# EasyEDA Pro project PD_Fan.eprj

# Schematic Schematic1
Create Date: 2024-09-08; Page Name: P1; Project Name: PD_Fan; Schematic Name: Schematic1; Update Date: 2024-09-22; Company: 嘉立创EDA; Page Size: A4; Version: V1.0
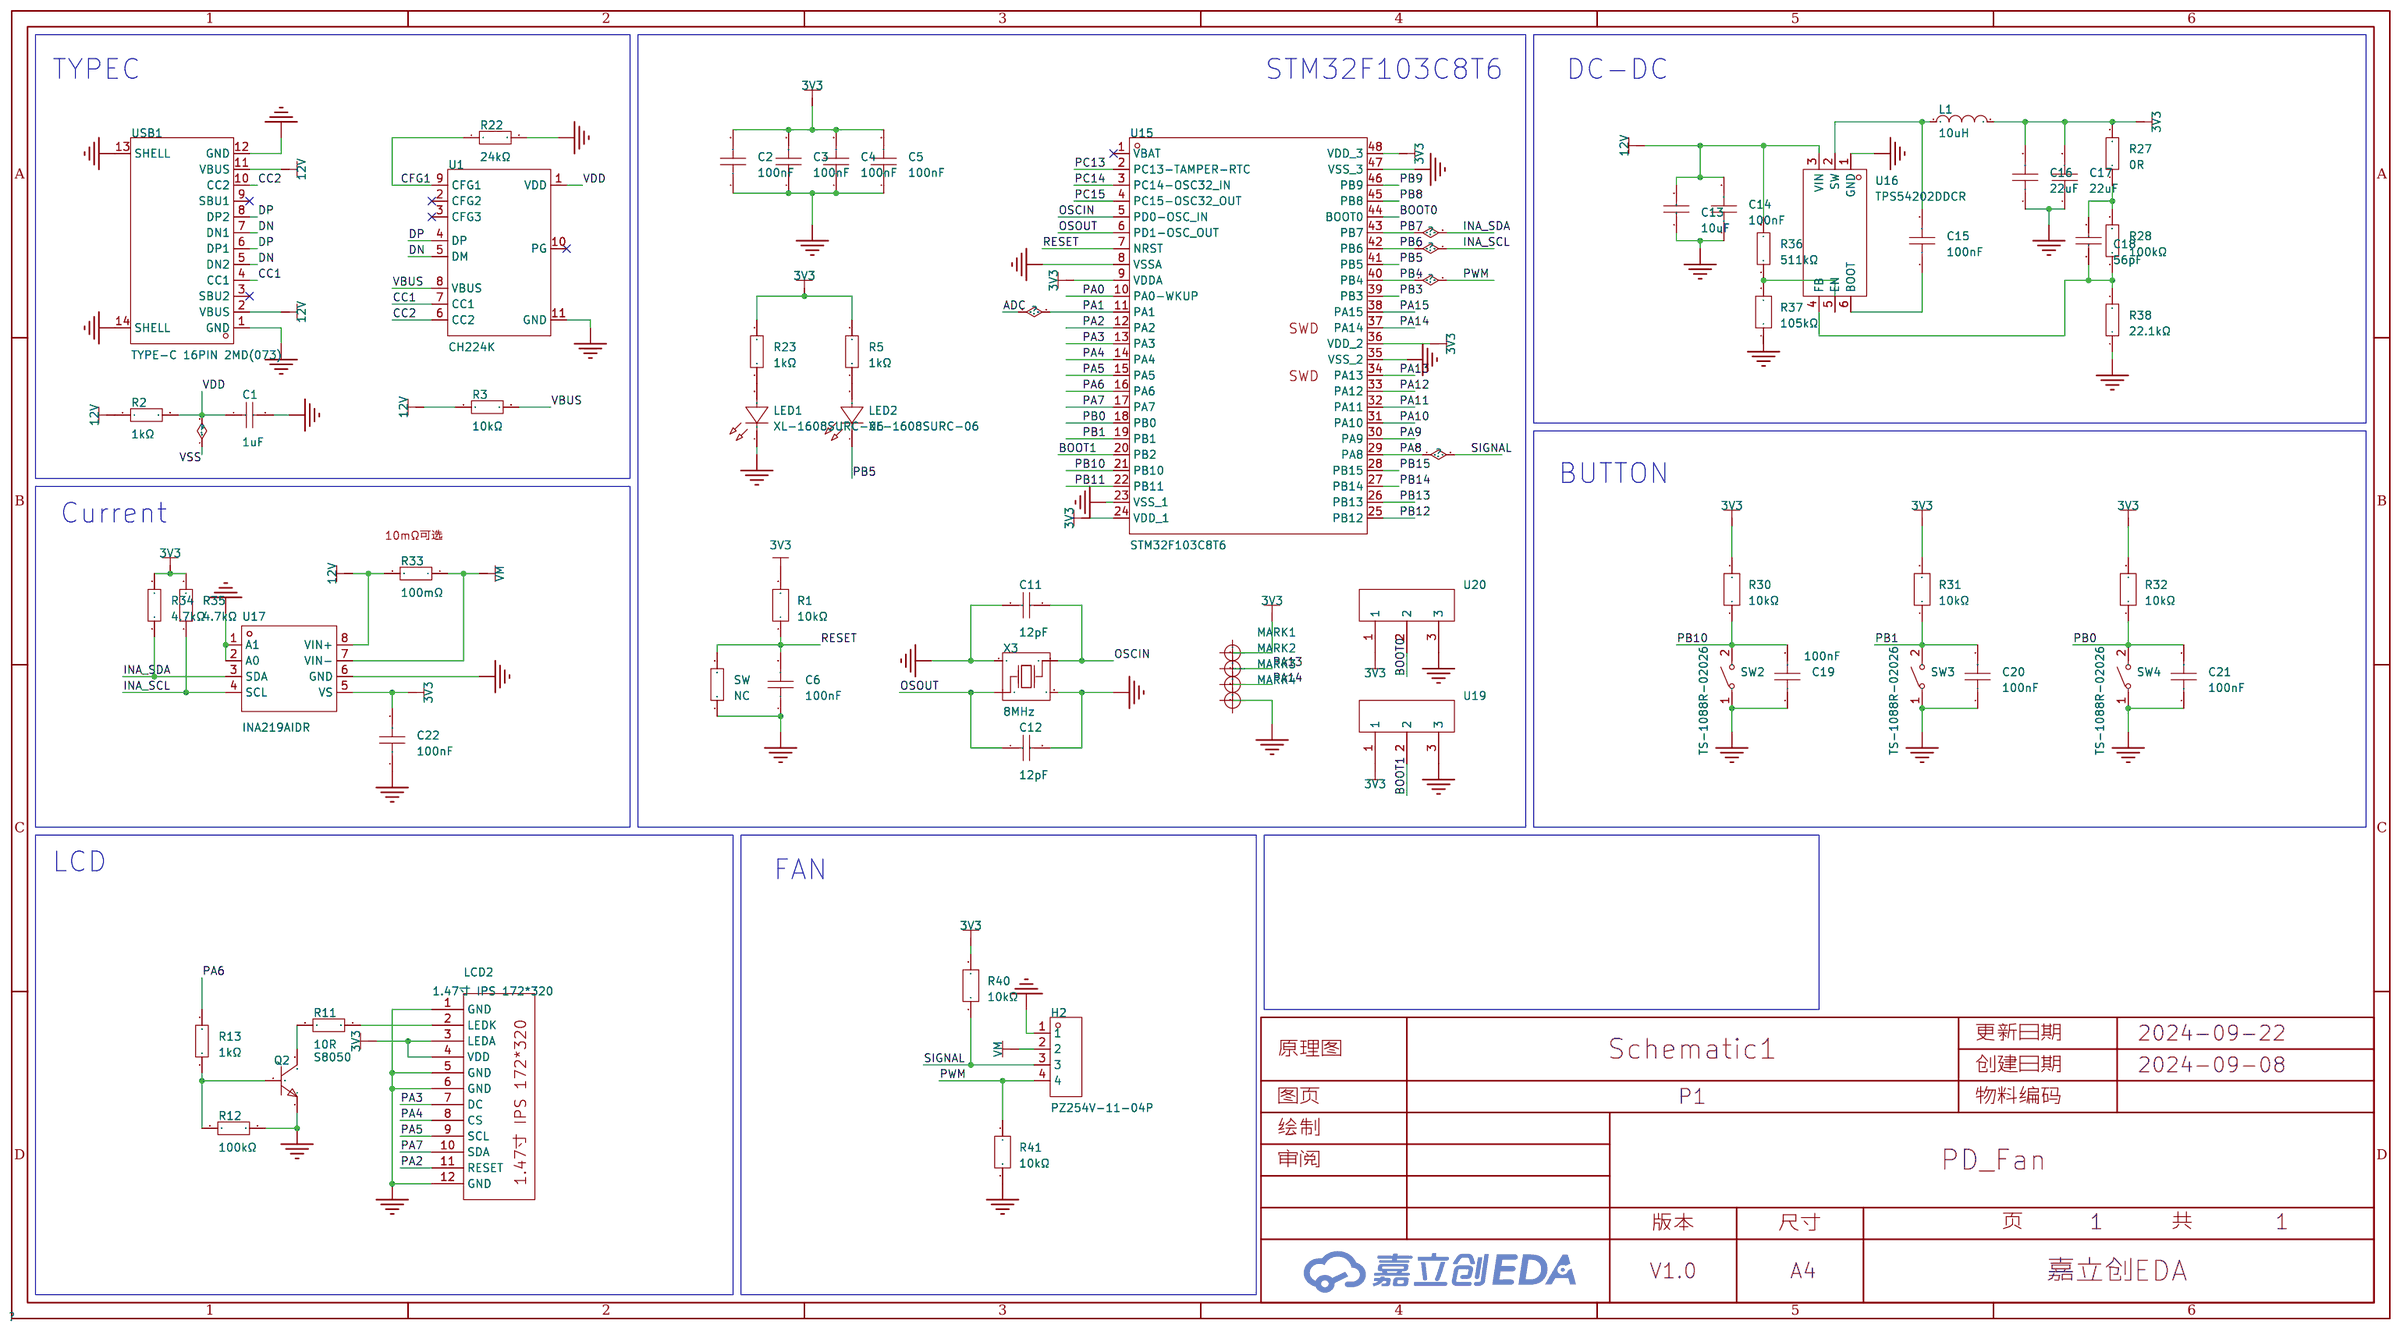
[diagram p0: schematic sheet]

## Parts
C1  1uF  [C0603]
C2  100nF  [C0603]
C3  100nF  [C0603]
C4  100nF  [C0603]
C5  100nF  [C0603]
C6  100nF  [C0603]
C11  12pF  [C0603]
C12  12pF  [C0603]
C13  10uF  [C0805]
C14  100nF  [C0603]
C15  100nF  [C0603]
C16  22uF  [C0805]
C17  22uF  [C0805]
C18  56pF  [C0603]
C19  100nF  [C0603]
C20  100nF  [C0603]
C21  100nF  [C0603]
C22  100nF  [C0603]
H2  PZ254V-11-04P  [HDR-TH_4P-P2.54-V-M]
L1  10uH  [IND-SMD_L2.5-W2.0]
LCD2  1.47寸 IPS 172*320  [1.47 ips lcd]
LED1  XL-1608SURC-06  [LED0603-RD_RED]
LED2  XL-1608SURC-06  [LED0603-RD_RED]
MARK1  -  [Mark-Point-1mm]  (no BOM)
MARK2  -  [Mark-Point-1mm]  (no BOM)
MARK3  -  [Mark-Point-1mm]  (no BOM)
MARK4  -  [Mark-Point-1mm]  (no BOM)
Q2  S8050  [SOT-23-3_L2.9-W1.3-P1.90-LS2.4-BR]
R1  10kΩ  [R0603]
R2  1kΩ  [R0603]
R3  10kΩ  [R0603]
R5  1kΩ  [R0603]
R11  10R  [R0603]
R12  100kΩ  [R0603]
R13  1kΩ  [R0603]
R22  24kΩ  [R0603]
R23  1kΩ  [R0603]
R27  0R  [R0603]
R28  100kΩ  [R0603]
R30  10kΩ  [R0603]
R31  10kΩ  [R0603]
R32  10kΩ  [R0603]
R33  100mΩ  [R1206]
R34  4.7kΩ  [R0603]
R35  4.7kΩ  [R0603]
R36  511kΩ  [R0603]
R37  105kΩ  [R0603]
R38  22.1kΩ  [R0603]
R40  10kΩ  [R0603]
R41  10kΩ  [R0603]
SW  10K  [R0603]
SW2  TS-1088R-02026  [SW-SMD_L3.9-W3.0-P4.45]
SW3  TS-1088R-02026  [SW-SMD_L3.9-W3.0-P4.45]
SW4  TS-1088R-02026  [SW-SMD_L3.9-W3.0-P4.45]
U1  CH224K  [ESSOP-10_L4.9-W3.9-P1.0-LS6.0-TL-EP]
U15  STM32F103C8T6  [LQFP-48_L7.0-W7.0-P0.50-LS9.0-BL]
U16  TPS54202DDCR  [SOT-23-6_L2.9-W1.6-P0.95-LS2.8-BL]
U17  INA219AIDR  [SOIC-8_L4.9-W3.9-P1.27-LS6.0-BL]
U19  -  [switch]
U20  -  [switch]
USB1  TYPE-C 16PIN 2MD(073)  [USB-C-SMD_TYPE-C-6PIN-2MD-073]
X3  8MHz  [OSC-SMD_4P-L3.2-W2.5-BL]

## Library data of the parts
C1 = CL10A105KB8NNNC: 容值:1uF;精度:±10%;额定电压:50V;材质(温度系数):X5R;; LCSC Part Name: 1uF ±10% 50V; Supplier Part: C15849; Manufacturer: SAMSUNG(三星); Supplier Footprint: 0603; JLCPCB Part Class: 基础库; Datasheet: https://atta.szlcsc.com/upload/public/pdf/source/20160218/1457707763339.pdf; Supplier: LCSC; Tolerance: ±10%; Voltage Rated: 50V; Temperature Coefficient: X5R
C2-C5 C14 C15 C19-C22 = CGA0603X7R104K500JT: 容值:100nF;精度:±10%;额定电压:50V;材质(温度系数):X7R;; LCSC Part Name: 100nF ±10% 50V; Supplier Part: C6119867; Manufacturer: HRE(芯声); Supplier Footprint: 0603; JLCPCB Part Class: Extended Part; Supplier: LCSC; Tolerance: ±10%; Voltage Rated: 50V; Temperature Coefficient: X7R
C6 = CC0603KRX7R9BB104: 容值:100nF;精度:±10%;额定电压:50V;材质(温度系数):X7R;; LCSC Part Name: 100nF ±10% 50V; Supplier Part: C14663; Manufacturer: YAGEO(国巨); Supplier Footprint: 0603; JLCPCB Part Class: Basic Part; Datasheet: https://atta.szlcsc.com/upload/public/pdf/source/20180910/C282072_33301C7F631E79921B82A8DAC6BCC5B3.pdf; Supplier: LCSC; Tolerance: ±10%; Voltage Rated: 50V; Temperature Coefficient: X7R
C11 C12 = CL10C120JB8NNNC: 容值:12pF;精度:±5%;额定电压:50V;材质(温度系数):C0G;; LCSC Part Name: 12pF ±5% 50V; Supplier Part: C38523; Manufacturer: SAMSUNG(三星); Supplier Footprint: 0603; JLCPCB Part Class: 基础库; Datasheet: https://atta.szlcsc.com/upload/public/pdf/source/20160218/1457707763339.pdf; Supplier: LCSC; Tolerance: ±5%; Voltage Rated: 50V; Temperature Coefficient: C0G
C13 = CL21A106KPFNNNE: 容值:10uF;精度:±10%;额定电压:10V;材质(温度系数):X5R;; LCSC Part Name: 10uF ±10% 10V; Supplier Part: C17024; Manufacturer: SAMSUNG(三星); Supplier Footprint: 0805; JLCPCB Part Class: 扩展库; Datasheet: https://atta.szlcsc.com/upload/public/pdf/source/20160218/1457707763339.pdf; Supplier: LCSC; Tolerance: ±10%; Voltage Rated: 10V; Temperature Coefficient: X5R
C16 C17 = CGA0805X5R226M350MT: 容值:22uF;精度:±20%;额定电压:35V;材质(温度系数):X5R;; LCSC Part Name: 22uF ±20% 35V; Supplier Part: C6119901; Manufacturer: HRE(芯声); Supplier Footprint: 0805; JLCPCB Part Class: 扩展库; Datasheet: https://atta.szlcsc.com/upload/public/pdf/source/20231129/D589D0CC4D260F7AC3A77E53B455CCB3.pdf; Supplier: LCSC; Tolerance: ±20%; Voltage Rated: 35V; Temperature Coefficient: X5R
C18 = CL10C560JB8NNNC: 容值:56pF;精度:±5%;额定电压:50V;材质(温度系数):C0G;; LCSC Part Name: 56pF ±5% 50V; Supplier Part: C39148; Manufacturer: SAMSUNG(三星); Supplier Footprint: 0603; JLCPCB Part Class: Extended Part; Datasheet: https://atta.szlcsc.com/upload/public/pdf/source/20160218/1457707763339.pdf; Supplier: LCSC; Tolerance: ±5%; Voltage Rated: 50V; Temperature Coefficient: C0G
H2 = PZ254V-11-04P: 插针结构:1x4P;间距:2.54mm;行距:-;圆针/方针:方针;安装类型:直插;排数:单排;总PIN位数:4P;额定电流:3A;额定电压:250V;配合针长度:6mm;塑高:2.5mm;端接针长度:3mm;触头材质:-;工作温度范围:-40℃~+105℃;颜色:黑色;; LCSC Part Name: 间距:2.54mm 1x4P 直插 方针; Supplier Part: C2691448; Manufacturer: XFCN(兴飞); Supplier Footprint: 插件,P=2.54mm; JLCPCB Part Class: Extended Part; Datasheet: https://atta.szlcsc.com/upload/public/pdf/source/20200309/C492403_F9F19131791D08044AD4F84F8E751A34.pdf; Supplier: LCSC; Pin Structure: 1x4P; Pitch: 2.54mm; Circluar Pins/Square Pins: 方针; Mounting Type: 直插; Number of Rows: 单排; Number of Pins: 4P; Current Rating (Max): 3A; Voltage Rating (Max): 250V; Length of Mating Pin: 6mm; Insulation Height: 2.5mm; Length of End Connection Pin: 3mm; Operating Temperature Range: -40℃~+105℃; Color: 黑色
L1 = FTC252012S100MBCA: 电感值:10uH;精度:±20%;额定电流:1.2A;饱和电流(Isat):1.6A;类型:一体成型电感;; LCSC Part Name: 10uH ±20% 1.6A; Supplier Part: C5832376; Manufacturer: cjiang(长江微电); Supplier Footprint: SMD,2x2.5mm; JLCPCB Part Class: 扩展库; Datasheet: https://atta.szlcsc.com/upload/public/pdf/source/20230602/8FFEDA9C0247A92A0D4B67554BFE4091.pdf; Supplier: LCSC; Tolerance: ±20%; Rated Current: 1.2A; Saturation Current (Isat): 1.6A; DC Resistance (DCR): 330mΩ; Type: 一体成型电感
LCD2 = 1.47寸 IPS 172*320
LED1 LED2 = XL-1608SURC-06: 发光颜色:红色;功率:55mW;正向电流:25mA;主波长:617nm~621nm;透镜颜色:无色透明透镜;色温:-;发光角度:120°;载带方式:正贴;工作温度:-30℃~+85℃;; Supplier Part: C965799; Manufacturer: XINGLIGHT(成兴光); Supplier Footprint: 0603; JLCPCB Part Class: 扩展库; Datasheet: https://atta.szlcsc.com/upload/public/pdf/source/20221102/D860AFDD1CDB02C5A8064103A32707E2.pdf; Supplier: LCSC; Emitted Color: 红色; Power Dissipation: 55mW; Forward Current: 25mA; Dominant Wavelength: 617nm~621nm; Peak Wavelength: 623nm; Lens Color: 无色透明透镜; Viewing Angle: 120°; Mounting Sytle: 正贴; Operating Temperature: -30℃~+85℃
MARK1-MARK4 = Mark-Point: Mark点
Q2 = S8050_C2891804: 晶体管类型:NPN;集电极电流(Ic):500mA;集射极击穿电压(Vceo):25V;功率(Pd):300mW;; LCSC Part Name: NPN 电流:500mA 耐压:25V; Supplier Part: C2891804; Manufacturer: YONGYUTAI(永裕泰); Supplier Footprint: SOT-23; JLCPCB Part Class: 扩展库; Datasheet: https://atta.szlcsc.com/upload/public/pdf/source/20210901/5347316A10609C628D4D69AE01446E5B.pdf; Supplier: LCSC; Transistor Type: NPN; Collector Current (Ic): 500mA; Collector-Emitter Breakdown Voltage (Vceo): 25V; Power Dissipation (Pd): 300mW; Collector Cut-Off Current (Icbo): 1uA; Collector-Emitter Saturation Voltage (VCE(sat)@Ic,Ib): 500mV@500mA,50mA
R1 R30-R32 R40 R41 = FRC0603J103TS: 电阻类型:厚膜电阻;阻值:10kΩ;精度:±5%;功率:100mW;最大工作电压:75V;温度系数:±100ppm/℃;; LCSC Part Name: 10kΩ ±5% 100mW 厚膜电阻; Supplier Part: C2930027; Manufacturer: FOJAN(富捷); Supplier Footprint: 0603; JLCPCB Part Class: Extended Part; Datasheet: https://atta.szlcsc.com/upload/public/pdf/source/20211221/925EC7D7225764EE0046F22065062C87.pdf; Supplier: LCSC; Type: 厚膜电阻; Tolerance: ±5%; Power(Watts): 100mW; Overload Voltage (Max): 75V; Temperature Coefficient: ±100ppm/℃; Operating Temperature Range: -55℃~+155℃
R2 = RC0603FR-071KL: 电阻类型:厚膜电阻;阻值:1kΩ;精度:±1%;功率:100mW;最大工作电压:75V;温度系数:±100ppm/℃;; LCSC Part Name: 厚膜电阻 1kΩ ±1% 100mW; Supplier Part: C22548; Manufacturer: YAGEO(国巨); Supplier Footprint: 0603; JLCPCB Part Class: 扩展库; Datasheet: https://atta.szlcsc.com/upload/public/pdf/source/20180316/70C0E2BDAE7FCC62C531A5A58D202EE1.pdf; Supplier: LCSC; Type: 厚膜电阻; Tolerance: ±1%; Power(Watts): 100mW; Overload Voltage (Max): 75V; Temperature Coefficient: ±100ppm/℃; Operating Temperature Range: -55℃~+155℃
R3 = 0603WAF1002T5E: 电阻类型:厚膜电阻;阻值:10kΩ;精度:±1%;功率:100mW;最大工作电压:75V;温度系数:±100ppm/℃;; LCSC Part Name: 厚膜电阻 10kΩ ±1% 100mW; Supplier Part: C25804; Manufacturer: UNI-ROYAL(厚声); Supplier Footprint: 0603; JLCPCB Part Class: Basic Part; Datasheet: https://atta.szlcsc.com/upload/public/pdf/source/20200306/C422600_1E6D84923E4A46A82E41ADD87F860B5C.pdf; Supplier: LCSC; Type: 厚膜电阻; Tolerance: ±1%; Power(Watts): 100mW; Overload Voltage (Max): 75V; Temperature Coefficient: ±100ppm/℃; Operating Temperature Range: -55℃~+155℃
R5 R23 = RC0603FR-071KL: 电阻类型:厚膜电阻;阻值:1kΩ;精度:±1%;功率:100mW;最大工作电压:75V;温度系数:±100ppm/℃;; LCSC Part Name: 厚膜电阻 1kΩ ±1% 100mW; Supplier Part: C22548; Manufacturer: YAGEO(国巨); Supplier Footprint: 0603; JLCPCB Part Class: Extended Part; Datasheet: https://atta.szlcsc.com/upload/public/pdf/source/20180316/70C0E2BDAE7FCC62C531A5A58D202EE1.pdf; Supplier: LCSC; Type: 厚膜电阻; Tolerance: ±1%; Power(Watts): 100mW; Overload Voltage (Max): 75V; Temperature Coefficient: ±100ppm/℃; Operating Temperature Range: -55℃~+155℃
R11 SW = Res_0603: Supplier Footprint: 0603
R12 R28 = RC0603FR-07100KL: 电阻类型:厚膜电阻;阻值:100kΩ;精度:±1%;功率:100mW;温度系数:±100ppm/℃;; LCSC Part Name: 厚膜电阻 100kΩ ±1% 100mW; Supplier Part: C14675; Manufacturer: YAGEO(国巨); Supplier Footprint: 0603; JLCPCB Part Class: 扩展库; Datasheet: https://atta.szlcsc.com/upload/public/pdf/source/20140324/1457707028752.pdf; Supplier: LCSC; Type: 厚膜电阻; Tolerance: ±1%; Power(Watts): 100mW; Temperature Coefficient: ±100ppm/℃; Overload Voltage (Max): 75V; Operating Temperature Range: -55℃~+155℃
R13 = RC0603FR-071KL: 电阻类型:厚膜电阻;阻值:1kΩ;精度:±1%;功率:100mW;; LCSC Part Name: 1kΩ ±1% 100mW; Supplier Part: C22548; Manufacturer: YAGEO(国巨); Supplier Footprint: 0603; JLCPCB Part Class: 扩展库; Datasheet: https://atta.szlcsc.com/upload/public/pdf/source/20180312/7BD3618A8B6324EA6280B0497A051AB7.pdf; Supplier: LCSC; Type: 厚膜电阻; Tolerance: ±1%; Power(Watts): 100mW; Overload Voltage (Max): 75V; Temperature Coefficient: ±100ppm/℃; Operating Temperature Range: -55℃~+155℃
R22 = 0603WAF2402T5E: 电阻类型:厚膜电阻;阻值:24kΩ;精度:±1%;功率:100mW;最大工作电压:75V;温度系数:±100ppm/℃;; LCSC Part Name: 24kΩ ±1% 100mW 厚膜电阻; Supplier Part: C23352; Manufacturer: UNI-ROYAL(厚声); Supplier Footprint: 0603; JLCPCB Part Class: 基础库; Datasheet: https://atta.szlcsc.com/upload/public/pdf/source/20200306/C422600_1E6D84923E4A46A82E41ADD87F860B5C.pdf; Supplier: LCSC; Type: 厚膜电阻; Tolerance: ±1%; Power(Watts): 100mW; Overload Voltage (Max): 75V; Temperature Coefficient: ±100ppm/℃; Operating Temperature Range: -55℃~+155℃
R27 = 0603WAF4992T5E: 电阻类型:厚膜电阻;阻值:49.9kΩ;精度:±1%;功率:100mW;最大工作电压:75V;温度系数:±100ppm/℃;; LCSC Part Name: 49.9kΩ ±1% 100mW 厚膜电阻; Supplier Part: C23184; Manufacturer: UNI-ROYAL(厚声); Supplier Footprint: 0603; JLCPCB Part Class: Basic Part; Datasheet: https://atta.szlcsc.com/upload/public/pdf/source/20200306/C422600_1E6D84923E4A46A82E41ADD87F860B5C.pdf; Supplier: LCSC; Type: 厚膜电阻; Tolerance: ±1%; Power(Watts): 100mW; Overload Voltage (Max): 75V; Temperature Coefficient: ±100ppm/℃; Operating Temperature Range: -55℃~+155℃
R33 = 1206W4F100LT5E: 电阻类型:厚膜电阻;阻值:100mΩ;精度:±1%;功率:250mW;最大工作电压:200V;温度系数:±800ppm/℃;; LCSC Part Name: 100mΩ ±1% 250mW 厚膜电阻; Supplier Part: C25334; Manufacturer: UNI-ROYAL(厚声); Supplier Footprint: 1206; JLCPCB Part Class: 基础库; Datasheet: https://atta.szlcsc.com/upload/public/pdf/source/20200306/C422600_1E6D84923E4A46A82E41ADD87F860B5C.pdf; Supplier: LCSC; Type: 厚膜电阻; Tolerance: ±1%; Power(Watts): 250mW; Overload Voltage (Max): 200V; Temperature Coefficient: ±800ppm/℃; Operating Temperature Range: -55℃~+155℃
R34 R35 = RC0603FR-074K7L: 电阻类型:厚膜电阻;阻值:4.7kΩ;精度:±1%;功率:100mW;最大工作电压:75V;温度系数:±100ppm/℃;; LCSC Part Name: 厚膜电阻 4.7kΩ ±1% 100mW; Supplier Part: C99782; Manufacturer: YAGEO(国巨); Supplier Footprint: 0603; JLCPCB Part Class: Extended Part; Datasheet: https://atta.szlcsc.com/upload/public/pdf/source/20180224/C181757_15194369480721363983.pdf; Supplier: LCSC; Type: 厚膜电阻; Tolerance: ±1%; Power(Watts): 100mW; Overload Voltage (Max): 75V; Temperature Coefficient: ±100ppm/℃; Operating Temperature Range: -55℃~+155℃
R36 = 0603WAF5113T5E: 电阻类型:厚膜电阻;阻值:511kΩ;精度:±1%;功率:100mW;最大工作电压:75V;温度系数:±100ppm/℃;; LCSC Part Name: 511kΩ ±1% 100mW 厚膜电阻; Supplier Part: C23194; Manufacturer: UNI-ROYAL(厚声); Supplier Footprint: 0603; JLCPCB Part Class: 扩展库; Datasheet: https://atta.szlcsc.com/upload/public/pdf/source/20200306/C422600_1E6D84923E4A46A82E41ADD87F860B5C.pdf; Supplier: LCSC; Type: 厚膜电阻; Tolerance: ±1%; Power(Watts): 100mW; Overload Voltage (Max): 75V; Temperature Coefficient: ±100ppm/℃; Operating Temperature Range: -55℃~+155℃
R37 = ERA3AEB1053V: 电阻类型:薄膜电阻;阻值:105kΩ;精度:±0.1%;功率:100mW;最大工作电压:75V;温度系数:±25ppm/℃;; LCSC Part Name: 薄膜电阻 105kΩ ±0.1% 100mW; Supplier Part: C491109; Manufacturer: PANASONIC(松下); Supplier Footprint: 0603; JLCPCB Part Class: 扩展库; Datasheet: https://atta.szlcsc.com/upload/public/pdf/source/20200407/C491109_E8B6AF7AD3C1B421CB5537416E5B0F6A.pdf; Supplier: LCSC; Type: 薄膜电阻; Tolerance: ±0.1%; Power(Watts): 100mW; Overload Voltage (Max): 75V; Temperature Coefficient: ±25ppm/℃; Operating Temperature Range: -55℃~+155℃
R38 = 0603WAF2212T5E: 电阻类型:厚膜电阻;阻值:22.1kΩ;精度:±1%;功率:100mW;最大工作电压:75V;温度系数:±100ppm/℃;; LCSC Part Name: 22.1kΩ ±1% 100mW 厚膜电阻; Supplier Part: C25961; Manufacturer: UNI-ROYAL(厚声); Supplier Footprint: 0603; JLCPCB Part Class: 扩展库; Datasheet: https://atta.szlcsc.com/upload/public/pdf/source/20200306/C422600_1E6D84923E4A46A82E41ADD87F860B5C.pdf; Supplier: LCSC; Type: 厚膜电阻; Tolerance: ±1%; Power(Watts): 100mW; Overload Voltage (Max): 75V; Temperature Coefficient: ±100ppm/℃; Operating Temperature Range: -55℃~+155℃
SW2-SW4 = TS-1088R-02026: 电路结构:单刀单掷;按钮形状:圆形按钮;安装方式:立贴;开关长度:3.9mm;开关宽度:2.93mm;开关高度:2mm;触点电流:50mA;额定电压(DC):12V;带灯:-;机械寿命:-;; LCSC Part Name: 3.9*2.93*2mm 立贴 轻触开关; Supplier Part: C455280; Manufacturer: XUNPU(讯普); Supplier Footprint: SMD,3x4mm; JLCPCB Part Class: 扩展库; Datasheet: https://atta.szlcsc.com/upload/public/pdf/source/20191118/C455281_EC5379764BC1462550DF64BBBFEA9579.pdf; Supplier: LCSC; Circuit: 单刀单掷; Actuator Style: 圆形按钮; Mounting Style: 立贴; Switch Length: 3.9mm; Switch Width: 2.93mm; Switch Height: 2mm; Contact Current: 50mA; Voltage Rating (DC): 12V
U1 = CH224K: 应用功能:USB充电芯片;; LCSC Part Name: USB PD等多快充协议受电芯片CH224; Supplier Part: C970725; Manufacturer: WCH(南京沁恒); Supplier Footprint: ESSOP-10-150mil-1mm; JLCPCB Part Class: 扩展库; Datasheet: https://atta.szlcsc.com/upload/public/pdf/source/20240313/43C2AFDDBDD1F65B60386D2CCAB0811B.pdf; Supplier: LCSC; Applications Function: USB充电芯片
U15 = STM32F103C8T6: CPU内核:ARM-M3;程序存储容量:64KB;RAM总容量:20KB;GPIO端口数量:37;工作电压范围:2V~3.6V;CPU最大主频:72MHz;程序存储器类型:FLASH;; Supplier Part: C8734; Manufacturer: ST(意法半导体); Supplier Footprint: LQFP-48(7x7); JLCPCB Part Class: 扩展库; Datasheet: https://atta.szlcsc.com/upload/public/pdf/source/20220812/8363ACEC51AD55ECEB84799464F7CB85.pdf; Supplier: LCSC; CPU Core: ARM-M3; Program Storage Size: 64KB; RAM Size: 20KB; GPIO Ports Number: 37; Operating Voltage Range: 2V~3.6V; CPU Maximum Speed: 72MHz; Program Memory Type: FLASH; Operating Temperature Range: -40℃~+85℃; ADC (Bit): 12bit; Universal Serial Bus: 有; Peripheral/Function: 看门狗；DMA；看门狗；温度传感器; Watchdog: 有; Infrared Data Association: 有; Low-Voltage Detect: 有; Direct Memory Access: 有; Internal Oscillator: 有
U16 = TPS54202DDCR: 功能类型:降压型;输出类型:可调;输入电压:4.5V~28V;输出电压:596mV~28V;输出电流(最大值):2A;; LCSC Part Name: 同步降压转换器; Supplier Part: C191884; Manufacturer: TI(德州仪器); Supplier Footprint: SOT-23-6; JLCPCB Part Class: 扩展库; Datasheet: https://www.ti.com/cn/lit/gpn/tps54202; Supplier: LCSC; Function: 降压型; Output Type: 可调; Input Voltage: 4.5V~28V; Output Voltage: 596mV~28V; Output Current (Max): 2A; Switching Frequency: 500kHz; Operating Temperature: -40℃~+125℃@(TJ); Synchronous Rectification: 是; Number of Outputs: 1; Topology: 降压式; Switch tube (built-in/external): 内置
U17 = INA219AIDR: INA219 26V、双向、零漂移、低侧/高侧、I2C 输出电流/功率监控器; Supplier Part: C138706; Manufacturer: TI(德州仪器); Supplier Footprint: SOIC-8; JLCPCB Part Class: 扩展库; Datasheet: https://www.ti.com/cn/lit/gpn/ina219; Supplier: LCSC
U19 U20 = switch
USB1 = TYPE-C 16PIN 2MD(073): 连接器类型:Type-C;标准:-;公母:母;端口数量:1;触点数量:16P;安装方式:卧贴;额定电流 - 电源:5A;工作温度范围:-25℃~+85℃;; LCSC Part Name: Type-C 母 卧贴; Supplier Part: C2765186; Manufacturer: SHOU HAN(首韩); Supplier Footprint: SMD; JLCPCB Part Class: 扩展库; Datasheet: https://atta.szlcsc.com/upload/public/pdf/source/20211123/39B17C16241EAC15C5E277BDA434118E.pdf; Supplier: LCSC; Connector Type: Type-C; Gender: 母; Number of Ports: 1; Number of Contacts: 16P; Mounting Style: 卧贴; Current Rating - Power (Max): 5A; Operating Temperature Range: -25℃~+85℃
X3 = TAXM8M4RDBCCT2T: 晶振类型:贴片晶振;频率:8MHz;常温频差:±10ppm;外接负载电容:10pF;频率稳定度(全温):±15ppm;; LCSC Part Name: 8MHz ±10ppm 10pF; Supplier Part: C400090; Manufacturer: YJX(雅晶鑫); Supplier Footprint: SMD3225-4P; JLCPCB Part Class: 扩展库; Datasheet: https://atta.szlcsc.com/upload/public/pdf/source/20190626/C400090_CF95B89E745AFE4EF2E392EF8AC009D6.pdf; Supplier: LCSC; Crystal Type: 贴片晶振; Normal temperature Frequency Tolerance: ±10ppm; External load capacitor: 10pF; Frequency Stability(Full temperature range): ±15ppm; Equivalent Series Resistance (ESR): 250Ω; Operating Temperature: -40℃~+85℃

## Nets
3V3: C2.2 C3.2 C4.2 C5.2 C16.2 C17.2 C22.2 L1.1 LCD2.3(LEDA) LCD2.4(VDD) MARK1.1 R1.2 R5.2 R23.2 R27.2 R30.2 R31.2 R32.2 R34.2 R35.2 R40.2 U15.9(VDDA) U15.24(VDD_1) U15.36(VDD_2) U15.48(VDD_3) U17.5(VS) U19.1 U20.1
12V: C13.2 C14.2 R2.1 R3.1 R33.2 R36.2 U16.3(VIN) U17.8(VIN+) USB1.2(VBUS) USB1.11(VBUS)
GND: C1.2 C2.1 C3.1 C4.1 C5.1 C6.1 C11.1 C12.2 C13.1 C14.1 C16.1 C17.1 C19.1 C20.1 C21.1 C22.1 H2.1 LCD2.1(GND) LCD2.5(GND) LCD2.6(GND) LCD2.12(GND) LED1.1(K) MARK4.1 Q2.2(E) R12.2 R22.2 R37.1 R38.1 R41.2 SW.1 SW2.1 SW3.1 SW4.1 U1.11(GND) U15.8(VSSA) U15.23(VSS_1) U15.35(VSS_2) U15.47(VSS_3) U16.1(GND) U17.1(A1) U17.2(A0) U17.6(GND) U19.3 U20.3 USB1.1(GND) USB1.12(GND) USB1.13(SHELL) USB1.14(SHELL) X3.2 X3.4
VBUS: R3.2 U1.8(VBUS)
VDD: C1.1 R2.2 U1.1(VDD)
ADC: U15.11(PA1)
BOOT0: U15.44(BOOT0) U20.2
BOOT1: U15.20(PB2) U19.2
CC1: U1.7(CC1) USB1.4(CC1)
CC2: U1.6(CC2) USB1.10(CC2)
CFG1: R22.1 U1.9(CFG1)
DN: U1.5(DM) USB1.5(DN2) USB1.7(DN1)
DP: U1.4(DP) USB1.6(DP1) USB1.8(DP2)
INA_SCL: R35.1 U15.42(PB6) U17.4(SCL)
INA_SDA: R34.1 U15.43(PB7) U17.3(SDA)
OSCIN: C11.2 U15.5(PD0-OSC_IN) X3.3
OSOUT: C12.1 U15.6(PD1-OSC_OUT) X3.1
PA0: U15.10(PA0-WKUP)
PA2: LCD2.11(RESET) U15.12(PA2)
PA3: LCD2.7(DC) U15.13(PA3)
PA4: LCD2.8(CS) U15.14(PA4)
PA5: LCD2.9(SCL) U15.15(PA5)
PA6: R13.2 U15.16(PA6)
PA7: LCD2.10(SDA) U15.17(PA7)
PA8: H2.3 R40.1 U15.29(PA8)
PA9: U15.30(PA9)
PA10: U15.31(PA10)
PA11: U15.32(PA11)
PA12: U15.33(PA12)
PA13: MARK2.1 U15.34(PA13)
PA14: MARK3.1 U15.37(PA14)
PA15: U15.38(PA15)
PB0: C21.2 R32.1 SW4.2 U15.18(PB0)
PB1: C20.2 R31.1 SW3.2 U15.19(PB1)
PB3: U15.39(PB3)
PB4: H2.4 R41.1 U15.40(PB4)
PB5: LED2.1(K) U15.41(PB5)
PB8: U15.45(PB8)
PB9: U15.46(PB9)
PB10: C19.2 R30.1 SW2.2 U15.21(PB10)
PB11: U15.22(PB11)
PB12: U15.25(PB12)
PB13: U15.26(PB13)
PB14: U15.27(PB14)
PB15: U15.28(PB15)
PC13: U15.2(PC13-TAMPER-RTC)
PC14: U15.3(PC14-OSC32_IN)
PC15: U15.4(PC15-OSC32_OUT)
RESET: C6.2 R1.1 SW.2 U15.7(NRST)
VM: H2.2 R33.1 U17.7(VIN-)
$1N1571: LED1.2(A) R23.1
$1N1572: LED2.2(A) R5.1
$1N3317: LCD2.2(LEDK) R11.2
$1N3330: Q2.3(C) R11.1
$1N3332: Q2.1(B) R12.1 R13.1
$1N4750: R36.1 R37.2 U16.5(EN)
$1N4786: C15.1 U16.6(BOOT)
$1N4858: C15.2 L1.2 U16.2(SW)
$1N5429: C18.2 R27.1 R28.2
$1N5438: C18.1 R28.1 R38.2 U16.4(FB)

Not connected (* = marked no-connect by the designer): U1 2(CFG2)* 3(CFG3)* 10(PG)*; U15 1(VBAT)*; USB1 3(SBU2)* 9(SBU1)*

## Notes on the sheet
- TYPEC
- STM32F103C8T6
- DC-DC
- SWD
- SWD
- BUTTON
- Current
- 10mΩ可选
- LCD
- FAN

# Board PCB1
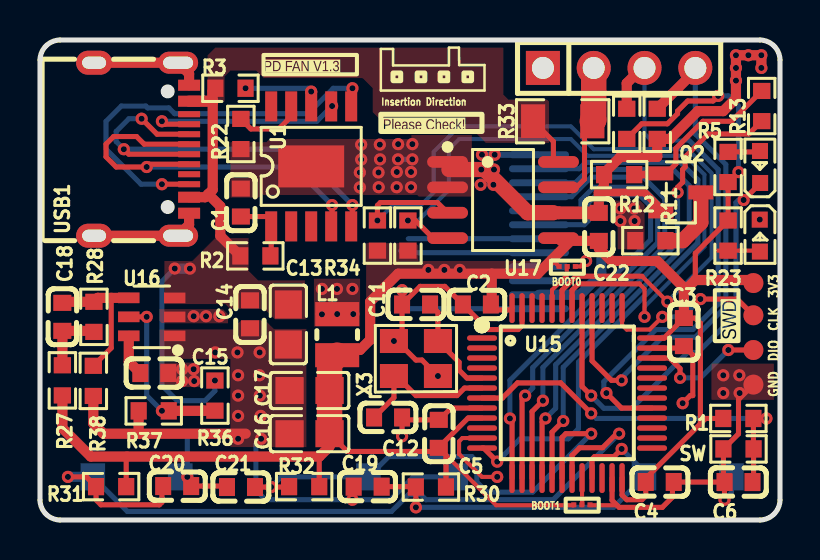
[diagram p1: board, top side]
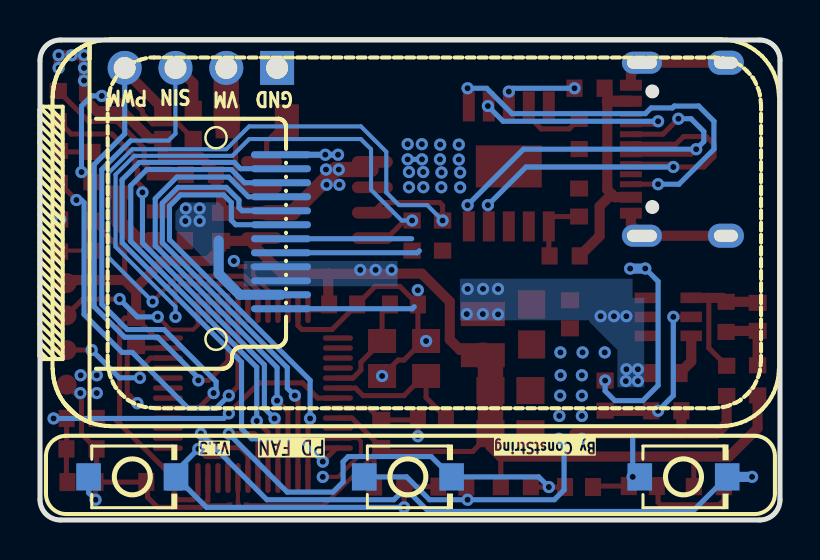
[diagram p2: board, bottom side, seen from below]

Outline 37 x 24 mm; copper layers: Top Layer, Bottom Layer. Coordinates in mm from the lower left corner of the outline.
Outline path: 0,22.98 0,1.02 arc(0.3,0.3) 1.02,0 35.98,0 arc(36.7,0.3) 37,1.02 37,22.98 arc(36.7,23.7) 35.98,24 1.02,24 arc(0.3,23.7) 0,22.98
Stack: Top Layer 0.035mm / Dielectric1 1.51mm FR4 er 4.5 / Bottom Layer 0.035mm

## Design rules (mm)
template: 自定义配置
spacing copperThickness1oz (default): track to track 0.102, other pairs 0.152 to 0.3
spacing copperThickness2oz: track to track 0.203, other pairs 0.152 to 0.3
track width copperThickness1oz (default): min 0.127, default 0.254, max 2.54
track width copperThickness2oz: min 0.203, default 0.254, max 2.54
differential pair differentialPair (default): width min 0.127, default 0.254, max 2.54; gap min 0.152, default 0.152
via viaSize (default): diameter min 0.5, default 0.61, max 10; hole min 0.3, default 0.305, max 6.3

## Placement (name value [footprint] x y rotation side)
3V3  -  [mark-point-1mm]  35.67 11.85 0 top
C1  1uF  [C0603]  10.04 15.87 90 top
C2  100nF  [C0603]  21.84 10.78 0 top
C3  100nF  [C0603]  32.19 9.39 90 top
C4  100nF  [C0603]  30.99 1.9 180 top
C5  100nF  [C0603]  19.94 4.31 270 top
C6  100nF  [C0603]  34.93 1.9 0 top
C11  12pF  [C0603]  18.8 10.78 0 top
C12  12pF  [C0603]  17.4 5.13 0 top
C13  10uF  [C0805]  12.42 9.78 90 top
C14  100nF  [C0603]  10.5 10.28 90 top
C15  100nF  [C0603]  5.72 7.35 0 top
C16  22uF  [C0805]  13.48 4.31 0 top
C17  22uF  [C0805]  13.48 6.47 0 top
C18  56pF  [C0603]  1.12 10.16 270 top
C19  100nF  [C0603]  16.38 1.67 0 top
C20  100nF  [C0603]  6.86 1.7 180 top
C21  100nF  [C0603]  10.05 1.65 0 top
C22  100nF  [C0603]  27.94 14.66 270 top
CLK  -  [mark-point-1mm]  35.67 10.23 0 top
DIO  -  [mark-point-1mm]  35.67 8.5 0 top
GND  -  [mark-point-1mm]  35.67 6.77 0 top
H2  PZ254V-11-04P  [HDR-TH_4P-P2.54-V-M]  28.96 22.6 0 top
L1  10uH  [IND-SMD_L2.5-W2.0]  14.86 9.27 270 top
LCD2  1.47寸 IPS 172*320  [1.47 ips lcd]  17.4 14 180 top
LED1  XL-1608SURC-06  [LED0603-RD_RED]  35.99 14.22 270 top
LED2  XL-1608SURC-06  [LED0603-RD_RED]  36 17.65 90 top
Q2  S8050  [SOT-23-3_L2.9-W1.3-P1.90-LS2.4-BR]  32.04 16.38 180 top
R1  10kΩ  [R0603]  34.92 5.08 180 top
R2  1kΩ  [R0603]  10.77 13.2 0 top
R3  10kΩ  [R0603]  9.52 21.59 0 top
R5  1kΩ  [R0603]  34.4 17.65 270 top
R11  10R  [R0603]  30.52 13.97 180 top
R12  100kΩ  [R0603]  28.96 17.27 180 top
R13  1kΩ  [R0603]  36.09 20.7 270 top
R22  24kΩ  [R0603]  10.04 19.3 270 top
R23  1kΩ  [R0603]  34.4 14.22 90 top
R27  0R  [R0603]  1.12 6.98 270 top
R28  100kΩ  [R0603]  2.7 10.16 270 top
R30  10kΩ  [R0603]  19.55 1.65 0 top
R31  10kΩ  [R0603]  3.56 1.67 0 top
R32  10kΩ  [R0603]  13.21 1.67 0 top
R33  100mΩ  [R1206]  26.14 19.94 180 top
R34  4.7kΩ  [R0603]  16.87 14.22 270 top
R35  4.7kΩ  [R0603]  18.4 14.22 270 top
R36  511kΩ  [R0603]  8.74 6.22 90 top
R37  105kΩ  [R0603]  5.69 5.46 0 top
R38  22.1kΩ  [R0603]  2.67 6.96 90 top
R40  10kΩ  [R0603]  29.34 19.81 270 top
R41  10kΩ  [R0603]  30.86 19.81 270 top
SW  10K  [R0603]  34.93 3.55 0 top
SW2  TS-1088R-02026  [SW-SMD_L3.9-W3.0-P4.45]  32.38 2.16 180 bottom
SW3  TS-1088R-02026  [SW-SMD_L3.9-W3.0-P4.45]  4.83 2.16 180 bottom
SW4  TS-1088R-02026  [SW-SMD_L3.9-W3.0-P4.45]  18.61 2.16 180 bottom
U1  CH224K  [ESSOP-10_L4.9-W3.9-P1.0-LS6.0-TL-EP]  13.56 17.68 0 top
U15  STM32F103C8T6  [LQFP-48_L7.0-W7.0-P0.50-LS9.0-BL]  26.35 6.35 270 top
U16  TPS54202DDCR  [SOT-23-6_L2.9-W1.6-P0.95-LS2.8-BL]  5.59 10.16 90 top
U17  INA219AIDR  [SOIC-8_L4.9-W3.9-P1.27-LS6.0-BL]  23.15 16 270 top
U19  -  [switch]  27.09 0.76 0 top
U20  -  [switch]  26.36 12.68 0 top
USB1  TYPE-C 16PIN 2MD(073)  [USB-C-SMD_TYPE-C-6PIN-2MD-073]  5.08 18.54 270 top
X3  8MHz  [OSC-SMD_4P-L3.2-W2.5-BL]  18.8 8.07 0 top

## Footprints (pads in the part's own frame, mm; a bottom-side part is the same pattern mirrored in y, then rotated)
1.47 ips lcd
  oval 3x0.35 smd far side: 1(-7.55,3.438) 2(-7.55,2.738) 3(-7.55,2.038) 4(-7.55,1.338) 5(-7.55,0.638) 6(-7.55,-0.062) 7(-7.55,-0.762) 8(-7.55,-1.462) 9(-7.55,-2.162) 10(-7.55,-2.862) 11(-7.55,-3.562) 12(-7.55,-4.262)
C0603
  rect 0.8x0.9 smd: 1(-0.7,0) 2(0.7,0)
C0805
  rect 1.41x1.35 smd: 1(-1,0) 2(1,0)
ESSOP-10_L4.9-W3.9-P1.0-LS6.0-TL-EP
  rect 0.6x1.5 smd: 1(-2,-3) 2(-1,-3) 3(0,-3) 4(1,-3) 5(2,-3) 6(2,3) 7(1,3) 8(0,3) 9(-1,3) 10(-2,3)
  rect 3.3x2.1 smd: 11(0,0)
HDR-TH_4P-P2.54-V-M
  rect 1.7x1.7 hole 1.1: 1(-3.81,0)
  round 1.7 hole 1.1: 2(-1.27,0) 3(1.27,0) 4(3.81,0)
IND-SMD_L2.5-W2.0
  rect 1.2x2.2 smd: 1(1.028,0) 2(-1.028,0)
LED0603-RD_RED
  rect 0.8x0.8 smd: 1(-0.799,-0.004) 2(0.799,0.004)
LQFP-48_L7.0-W7.0-P0.50-LS9.0-BL
  oval 0.27x1.5 smd: 1(-2.75,-4.25) 2(-2.25,-4.25) 3(-1.75,-4.25) 4(-1.25,-4.25) 5(-0.75,-4.25) 6(-0.25,-4.25) 7(0.25,-4.25) 8(0.75,-4.25) 9(1.25,-4.25) 10(1.75,-4.25) 11(2.25,-4.25) 12(2.75,-4.25) 25(2.75,4.25) 26(2.25,4.25) 27(1.75,4.25) 28(1.25,4.25) 29(0.75,4.25) 30(0.25,4.25) 31(-0.25,4.25) 32(-0.75,4.25) 33(-1.25,4.25) 34(-1.75,4.25) 35(-2.25,4.25) 36(-2.75,4.25)
  oval 1.5x0.27 smd: 13(4.25,-2.75) 14(4.25,-2.25) 15(4.25,-1.75) 16(4.25,-1.25) 17(4.25,-0.75) 18(4.25,-0.25) 19(4.25,0.25) 20(4.25,0.75) 21(4.25,1.25) 22(4.25,1.75) 23(4.25,2.25) 24(4.25,2.75) 37(-4.25,2.75) 38(-4.25,2.25) 39(-4.25,1.75) 40(-4.25,1.25) 41(-4.25,0.75) 42(-4.25,0.25) 43(-4.25,-0.25) 44(-4.25,-0.75) 45(-4.25,-1.25) 46(-4.25,-1.75) 47(-4.25,-2.25) 48(-4.25,-2.75)
mark-point-1mm
  round 1 smd: 1(0,0)
OSC-SMD_4P-L3.2-W2.5-BL
  rect 1.4x1.2 smd: 1(-1.1,-0.875) 2(1.1,-0.875) 3(1.1,0.875) 4(-1.1,0.875)
R0603
  rect 0.806x0.864 smd: 1(-0.753,0) 2(0.753,0)
R1206
  rect 1.208x1.701 smd: 1(-1.479,0) 2(1.479,0)
SOIC-8_L4.9-W3.9-P1.27-LS6.0-BL
  oval 0.588x2.045 smd: 1(-1.905,-2.772) 2(-0.635,-2.772) 3(0.635,-2.772) 4(1.905,-2.772) 5(1.905,2.772) 6(0.635,2.772) 7(-0.635,2.772) 8(-1.905,2.772)
SOT-23-3_L2.9-W1.3-P1.90-LS2.4-BR
  rect 1.25x0.7 smd: 1(1,-0.95) 2(1,0.95) 3(-1,0)
SOT-23-6_L2.9-W1.6-P0.95-LS2.8-BL
  rect 0.532x1.072 smd: 1(-0.95,-1.149) 2(0,-1.149) 3(0.95,-1.149) 4(0.95,1.149) 5(0,1.149) 6(-0.95,1.149)
SW-SMD_L3.9-W3.0-P4.45
  rect 1.23x1.36 smd: 1(-2.185,0) 2(2.185,0)
switch
  custom 0.254x0.243 smd: 1(-0.406,0) 2(0,0) 3(0.406,0)
USB-C-SMD_TYPE-C-6PIN-2MD-073
  rect 0.55x1.1 smd: 1(-3.2,2.375) 2(-2.4,2.375) 11(2.4,2.375) 12(3.2,2.375)
  rect 0.3x1.1 smd: 3(-1.75,2.375) 4(-1.25,2.375) 5(-0.75,2.375) 6(-0.25,2.375) 7(0.25,2.375) 8(0.75,2.375) 9(1.25,2.375) 10(1.75,2.375)
  oval 1.1x2 hole 0.6x1.5: 13(-4.325,1.825) 14(4.325,1.825)
  oval 1.2x1.8 hole 0.6x1.2: 13(-4.325,-2.375) 14(4.325,-2.375)

## Nets
As in the schematic, except:
3V3: 3V3.1 C2.2 C3.2 C4.2 C5.2 C16.2 C17.2 C22.2 L1.1 LCD2.3 LCD2.4 R1.2 R5.2 R23.2 R27.2 R30.2 R31.2 R32.2 R34.2 R35.2 R40.2 U15.9 U15.24 U15.36 U15.48 U17.5 U19.1 U20.1
GND: C1.2 C2.1 C3.1 C4.1 C5.1 C6.1 C11.1 C12.2 C13.1 C14.1 C16.1 C17.1 C19.1 C20.1 C21.1 C22.1 GND.1 H2.1 LCD2.1 LCD2.5 LCD2.6 LCD2.12 LED1.1 Q2.2 R12.2 R22.2 R37.1 R38.1 R41.2 SW.1 SW2.1 SW3.1 SW4.1 U1.11 U15.8 U15.23 U15.35 U15.47 U16.1 U17.1 U17.2 U17.6 U19.3 U20.3 USB1.1 USB1.12 USB1.13 USB1.14 X3.2 X3.4
PA13: DIO.1 U15.34
PA14: CLK.1 U15.37

Pads without a net: U1 2 3 10; U15 1; USB1 3 9

## Via types
v1: diameter 0.61, hole 0.305, Top Layer to Bottom Layer, 119 vias

## Routing (per net, layer and track width the routed paths; a pad name or vN(x,y) marks a point on that pad's centre or on a via; arc(x,y) is an arc through that point)
3V3: length 106.5
  Top Layer w0.203: 25.95,12.68 25.63,13 25.58,13 ; U19.1 26.67,0.74 22.81,0.74 20.3,3.25
  Top Layer w0.254: 20.12,3.43 15.37,3.43 14.48,4.31 ; 20.12,3.43 20.19,3.43 20.19,3.89 21.4,5.1 U15.9 ; 20.12,3.43 C5.2 ; 20.12,3.43 20.3,3.25 R30.2 ; R32.2 13.96,3.16 13.97,3.17 ; 25.67,14.09 U17.5 ; U15.48 23.51,10.5 22.8,10.5 ; R40.2 30.09,19.81 31.37,19.81 31.88,20.32 31.88,20.44 32.38,20.95 33.66,20.95 v1(33.91,21.21) ; 33.02,4.81 33.28,5.08 R1.2 ; 33.02,4.81 30.29,2.08 C4.2 30.29,1.2 30.1,1.01 29.34,1.01 29.1,1.25 U15.24 ; 33.02,4.81 33.02,9.84 32.77,10.09 C3.2 31.2,9.1 U15.36 ; 4.35,3.17 4.31,3.13 R31.2 ; v1(34.93,17.4) 34.43,16.9 R5.2 R23.2 32.77,13.34 32.77,12
  Top Layer w0.508: C2.2 22.59,10.82 22.59,12.32 ; 22.59,12.32 17.91,12.32 16.51,10.92 16.51,9.01 16,8.51 15.12,8.51 L1.1 15.61,8.24 ; 22.59,12.32 24.89,12.32 26.53,13.96 ; 32.19,11.43 32.19,11.62 30.86,12.95 28.57,12.95 27.94,13.59 C22.2 26.53,13.96 ; 32.19,11.43 C3.2 ; 32.19,11.43 32.77,12 35.39,12 35.67,11.72 ; 14.48,4.31 14.48,3.68 13.97,3.17 2.54,3.17 1.12,4.59 R27.2 ; U17.5 26.06,13.96 26.53,13.96
  Top Layer w1.27: 14.48,4.31 C17.2 14.48,7.86 L1.1
  Bottom Layer w0.254: v1(34.93,17.4) 34.93,20.7 34.42,21.21 v1(33.91,21.21)
  vias: v1(19.42,12.5) v1(20.22,12.5) v1(20.99,12.5)
12V: length 24.4
  Top Layer w0.254: R33.2 25.67,18.92 25.67,17.9
  Top Layer w0.508: 8.41,16.29 8.26,16.14 USB1.11 ; 8.41,16.29 9.02,15.69 9.02,14.2 R2.1 ; 8.41,16.29 8.64,16.52 8.64,21.45 R3.1
  Top Layer w0.559: 8.64,20.93 8.62,20.94 USB1.2
  Bottom Layer w0.254: v1(8.74,6.97) 8.74,6.46 8.25,5.97 6.86,5.97 6.1,6.73 6.1,11.93 v1(6.74,12.57)
  Bottom Layer w0.508: v1(7.49,12.57) 6.74,12.57 v1(6.74,12.57)
GND: length 132.2
  Top Layer w0.203: 27.49,0.74 28.85,0.74 ; v1(27.31,12.95) 27.03,12.68 U20.3
  Top Layer w0.254: v1(7.37,2.16) 7.37,1.89 C20.1 9.3,1.7 C21.1 ; U15.47 24.1,9.72 23.9,9.52 22.4,9.52 C2.1 20.24,11.68 19.01,11.68 18.11,10.78 ; v1(18.11,11.49) 18.11,10.78 ; 18.11,10.78 C11.1 18.1,9.36 v1(17.7,8.95) 17.84,8.95 18.8,8 19.1,8 v1(19.9,7.2) ; v1(32.13,5.84) 32.51,6.22 32.64,6.22 32.64,8.25 C3.1 32.1,8.6 U15.35 ; v1(15.62,1.01) 15.62,1.6 C19.1 ; v1(18.1,4.19) C12.2 18.22,5.01 C5.1 ; 34.22,1.9 v1(34.22,1.01) ; 34.22,1.9 31.69,1.9 C4.1 31.62,1.84 31.62,1.14 31.12,0.63 28.96,0.63 28.6,0.99 U15.23 ; 34.22,1.9 34.17,1.95 SW.1 34.93,4.31 34.93,6.02 GND.1 ; U15.8 20.55,5.6 20.19,5.24 20.19,5.01
  Top Layer w0.381: 27.94,16.38 30.22,16.38 31.04,15.56 Q2.2
  Top Layer w0.508: USB1.14 USB1.14 7.46,14.76 USB1.12 ; R37.1 4.93,4.33 4.95,4.31 ; USB1.13 USB1.13 7.46,22.31 USB1.1 ; 4.95,4.31 10.29,4.31 ; 4.95,4.31 3.18,4.31 2.67,4.82 R38.1 ; v1(36.07,22.6) v1(36.07,23.24) v1(35.42,23.24) v1(34.8,23.24) v1(34.8,22.6) v1(34.8,21.97) 34.8,21.08 34.16,20.44 32.89,20.44 31.5,19.06 R41.2 30.86,18.16 29.02,18.16 28.19,17.33 28.19,16.64 27.94,16.38 C22.1 28.07,15.36
  Top Layer w0.635: C22.1 25.93,15.36 U17.6
  Top Layer w0.762: 20.45,17.52 22.22,17.52 24.38,15.36 25.67,15.36
  Bottom Layer w0.254: 18.03,13.46 18.13,13.36 LCD2.5 ; SW4.1 18.67,2.16 17.53,1.01 v1(15.62,1.01) 11.28,1.01 10.79,1.5 10.79,3.8 v1(11.06,4.06) ; 18.29,10.67 18.39,10.56 LCD2.1 ; v1(7.37,2.16) SW3.1 7.37,2.51 7.37,4.19 ; SW2.1 34.57,1.36 v1(34.22,1.01) ; v1(17.9,18.03) v1(18.62,18.03) ; LCD2.6 18.41,14.06
  Bottom Layer w0.305: v1(22.1,18.26) v1(22.74,18.26) LCD2.12
  vias: v1(8.76,8.38) v1(9.87,8.38) v1(9.91,7.24) v1(9.91,6.22) v1(9.91,5.2) v1(9.91,4.06) v1(10.98,8.38) v1(10.97,7.24) v1(10.99,6.22) v1(11.03,5.2) v1(15.99,17.38) v1(15.99,16.63) v1(16.06,18.77) v1(16.06,18.02) v1(16.93,17.38) v1(16.94,16.64) v1(16.99,18.77) v1(17,18.03) v1(17.84,17.4) v1(17.83,16.64) v1(17.91,18.79) v1(18.62,18.79) v1(18.55,17.4) v1(18.55,16.64) v1(22.03,16.76) v1(22.06,17.52) v1(22.7,17.52) v1(22.67,16.76) v1(34.16,7.24) v1(34.16,6.35) v1(34.97,7.24) v1(34.98,6.35) v1(35.99,15.02)
VBUS: length 3.4
  Bottom Layer w0.254: v1(13.56,21.42) 13.39,21.59 v1(10.28,21.59)
VDD: length 3.5
  Top Layer w0.254: C1.1 11.54,15.17 11.56,15.19 11.56,13.25 R2.2
ADC: length 4.2
  Top Layer w0.203: U15.11 21.12,4.1 20.96,3.93 20.96,3.3 22.1,2.16 v1(22.86,2.16)
BOOT0: length 2.3
  Top Layer w0.203: 26.34,12.59 26.34,12.24 25.6,11.5 U15.44
BOOT1: length 1.4
  Top Layer w0.203: U15.20 27.1,0.97 27.11,0.96 27.11,0.74
CC1: length 10.8
  Top Layer w0.203: 14.56,21.19 14.56,20.74 v1(14.6,20.7)
  Top Layer w0.254: USB1.4 6.24,19.79 v1(6.1,19.94)
  Bottom Layer w0.254: v1(6.1,19.94) 13.84,19.94 v1(14.6,20.7)
CC2: length 20
  Top Layer w0.203: 15.56,21.19 15.56,21.53 v1(15.62,21.59)
  Top Layer w0.254: USB1.10 v1(6.1,16.79)
  Bottom Layer w0.254: v1(6.1,16.79) 5.05,16.79 3.3,18.54 3.3,19.94 4.06,20.7 5.29,20.7 5.38,20.6 6.44,20.6 6.73,20.32 13.4,20.32 14.67,21.59 v1(15.62,21.59)
CFG1: length 4
  Top Layer w0.254: R22.1 10.54,19.56 11.94,19.56 12.56,20.18 12.56,21.19
DN: length 21.8
  Top Layer w0.254: USB1.7 4.44,18.29 v1(4.19,18.54) ; 15.56,15.19 15.62,15.25 v1(15.62,15.75) ; v1(5.08,20.06) 5.85,19.29 USB1.5
  Bottom Layer w0.254: v1(5.08,20.06) 4.44,20.06 3.81,19.43 3.81,18.92 v1(4.19,18.54) 12.83,18.54 v1(15.62,15.75)
DP: length 20.2
  Top Layer w0.254: v1(14.6,15.75) 14.6,15.23 14.56,15.19 ; USB1.8 5.47,17.79 v1(5.33,17.65) 3.81,17.65 3.3,18.16 3.3,18.79 3.68,19.17 4.83,19.17 5.21,18.79 USB1.6
  Bottom Layer w0.254: v1(14.6,15.75) 12.7,17.65 v1(5.33,17.65)
INA_SCL: length 35.3
  Top Layer w0.203: 29.97,11.81 30.23,11.55 v1(30.23,10.16)
  Top Layer w0.254: U17.4 19.65,14.09 18.77,14.97 v1(18.4,14.97) ; U15.42 26.6,11.49 26.92,11.81 29.97,11.81
  Bottom Layer w0.203: v1(18.4,14.97) 18.91,14.97 20.45,16.51 20.45,18.54 20.96,19.05 26.54,19.05 27.38,18.21 32.28,18.21 33.22,17.27 33.22,13.66 30.23,10.67 v1(30.23,10.16)
INA_SDA: length 39.7
  Top Layer w0.203: v1(31.37,10.92) 30.1,12.19
  Top Layer w0.254: U17.3 19.87,15.87 17.02,15.87 16.87,15.73 v1(16.87,14.97) ; 30.1,12.19 26.8,12.19 26.1,11.49 U15.43
  Bottom Layer w0.203: v1(31.37,10.92) 33.58,13.13 33.58,17.34 32.38,18.54 27.69,18.54 26.54,19.68 20.96,19.68 19.69,18.41 19.69,16.38 19.05,15.75 17.64,15.75 v1(16.87,14.97)
OSCIN: length 5.2
  Top Layer w0.254: U15.5 21.35,7.1 20.96,7.49 20.96,7.89 X3.3 19.9,10.38 C11.2
OSOUT: length 7.3
  Top Layer w0.254: 17.82,7.2 18.8,6.22 20.85,6.22 21.23,6.6 U15.6 ; X3.1 17.7,6.12 C12.1
PA2: length 29
  Top Layer w0.254: v1(22.86,2.92) 22.18,3.6 U15.12
  Bottom Layer w0.254: 22.99,3.05 24,4.06 26.42,4.06 26.92,4.57 26.92,7.9 32.89,13.87 32.89,17.02 32.03,17.88 27.28,17.88 26.97,17.56 LCD2.11
PA3: length 23.5
  Top Layer w0.254: U15.13 23.6,4.97 v1(23.5,5.08)
  Bottom Layer w0.254: v1(23.5,5.08) 23.5,6.98 30.53,14.01 30.53,15.7 29.97,16.25 27.81,16.25 27.43,15.87 27.43,14.98 27.21,14.76 LCD2.7
PA4: length 23.5
  Top Layer w0.254: U15.14 24.1,6.07 v1(24.26,6.22)
  Bottom Layer w0.254: LCD2.8 26.9,15.46 27.05,15.62 27.05,16 27.69,16.63 30.1,16.63 30.88,15.85 30.88,13.87 24.64,7.62 24.64,6.6 v1(24.26,6.22)
PA5: length 23.9
  Top Layer w0.254: U15.15 24.6,5.42 v1(25.15,5.97)
  Bottom Layer w0.254: v1(25.15,5.97) 25.15,7.63 31.24,13.72 31.24,16.06 30.16,17.14 27.56,17.14 26.58,16.16 LCD2.9
PA6: length 23.6
  Top Layer w0.254: U15.16 25.1,4.91 v1(25.27,5.08) ; R13.2 35.44,19.3 33.4,19.3 32.26,18.16 32.26,17.65 32.13,17.52 32.13,16.89 31.88,16.63 v1(31.88,16.38)
  Bottom Layer w0.254: v1(31.88,16.38) 31.88,13.86 25.78,7.76 25.78,5.58 v1(25.27,5.08)
PA7: length 25.6
  Top Layer w0.254: v1(26.16,4.95) 25.6,4.39 U15.17
  Bottom Layer w0.254: LCD2.10 26.77,16.86 27.43,17.52 31.66,17.52 32.46,16.72 32.46,13.94 26.16,7.64 v1(26.16,4.95)
PA8: length 27.6
  Top Layer w0.254: v1(28.32,6.35) 29.07,5.6 U15.29
  Top Layer w0.508: R40.1 29.34,21.84 30.23,22.73
  Bottom Layer w0.203: 32.46,18.97 30.58,18.97 30.23,19.32 30.23,22.73
  Bottom Layer w0.254: 32.46,18.97 33.91,17.52 33.91,10.79 32.64,9.52 30.8,9.52 28.19,6.92 28.19,6.47 v1(28.32,6.35)
PA13: length 6.3
  Top Layer w0.254: U15.34 31.48,8.1 32,7.57 v1(32,7.11) ; DIO.1 v1(34.42,8.5)
  Bottom Layer w0.254: v1(34.42,8.5) 33.03,7.11 v1(32,7.11)
PA14: length 8.5
  Top Layer w0.203: v1(31.12,10.16) 30.48,9.52 29.34,9.52 29.1,9.76 U15.37
  Top Layer w0.254: CLK.1 34.86,11.05 33.02,11.05
  Bottom Layer w0.254: v1(31.12,10.16) 32.13,10.16 v1(33.02,11.05)
PB0: length 24.5
  Top Layer w0.254: C21.2 v1(11.56,1.65) 12.43,1.65 R32.1 ; v1(27.56,4.31) 26.29,4.31 26.1,4.13 U15.18
  Bottom Layer w0.254: v1(27.56,4.31) 24.64,1.39 22.35,1.39 21.84,1.9 21.84,2.92 21.59,3.17 17.44,3.17 SW4.2 12.06,2.16 v1(11.56,1.65)
PB1: length 40.6
  Top Layer w0.254: U15.19 26.6,3.23 26.98,3.61 28.13,3.61 28.83,4.31 v1(28.96,4.31) ; v1(1.4,2.16) 2.32,2.16 R31.1 2.8,1 3.05,0.76 5.97,0.76 6.1,0.89 6.1,1.63 C20.2
  Bottom Layer w0.254: v1(28.96,4.31) 25.65,1.01 19.3,1.01 19.05,1.27 18.41,1.27 17.57,0.43 4.37,0.43 SW3.2
  Bottom Layer w0.508: SW3.2 v1(1.4,2.16)
PB4: length 27
  Top Layer w0.254: U15.40 27.6,7.95 28.57,6.98 v1(29.08,6.98)
  Top Layer w0.508: 32.77,22.73 32.77,22.47 R41.1
  Bottom Layer w0.254: 32.77,22.73 32.77,19.3 34.29,17.78 34.29,10.67 32.77,9.14 31.12,9.14 29.08,7.11 v1(29.08,6.98)
PB5: length 21.2
  Top Layer w0.254: v1(35.18,16) 36.01,16.83 LED2.1 ; U15.41 27.1,6.68 v1(27.56,6.22)
  Bottom Layer w0.254: v1(35.18,16) 34.93,16 34.8,15.87 34.8,10.28 32.89,8.38 32.38,8.38 29.59,5.58 28.19,5.58 v1(27.56,6.22)
PB10: length 19.3
  Top Layer w0.254: U15.21 27.6,3.05 27.73,3.17 28.7,3.17 v1(29.08,3.55) ; v1(18.8,0.63) 18.8,1.64 R30.1 18.77,1.67 C19.2
  Bottom Layer w0.254: v1(18.8,0.63) 28.68,0.63 SW2.2 30.2,2.44 v1(29.08,3.55)
RESET: length 19.1
  Top Layer w0.254: C6.2 35.68,1.95 35.68,3.55 ; v1(27.56,5.33) 26.03,6.86 23.88,6.86 23.12,6.1 U15.7 ; SW.2 35.67,3.56 35.67,5.08 v1(36.32,5.08)
  Bottom Layer w0.254: v1(27.56,5.33) 27.81,5.08 v1(36.32,5.08)
VM: length 7.6
  Top Layer w0.254: R33.1 27.22,19.55 27.22,17.04 26.82,16.63 25.67,16.63
  Top Layer w1.27: 27.69,22.73 27.69,20.01 R33.1
$1N1571: length 1.9
  Top Layer w0.203: 33.9,13.47 R23.1 35.69,13.47 35.74,13.42
$1N1572: length 1.6
  Top Layer w0.254: LED2.2 35.95,18.4 R5.1
$1N3317: length 5.2
  Bottom Layer w0.508: LCD2.2 27.01,11.26 28.07,12.32 28.07,13.97
  vias: v1(29.02,15.58) v1(29.02,14.95) v1(29.71,15.58) v1(29.73,14.95)
$1N3330: length 3.4
  Top Layer w0.762: 33.04,16.13 33.04,14.88 32.13,13.97 R11.1
$1N3332: length 8.6
  Top Layer w0.254: R13.1 34.57,19.94 33.15,19.94 31.79,18.58 31.79,17.81 31.32,17.33 Q2.1
  Top Layer w0.381: R12.1 30.98,17.27 Q2.1
$1N4750: length 8.6
  Top Layer w0.254: v1(6.1,5.46) R37.2 ; U16.5 v1(5.33,10.16)
  Top Layer w0.508: R37.2 8.2,5.46 8.21,5.47 R36.1
  Bottom Layer w0.254: v1(6.1,5.46) 5.33,6.22 v1(5.33,10.16)
$1N4786: length 2.1
  Top Layer w0.508: C15.1 4.44,7.92 U16.6
$1N4858:
  vias: v1(7.1,7.54) v1(7.1,6.95) v1(7.68,10.19) v1(7.68,7.54) v1(7.71,6.95) v1(8.3,10.19) v1(8.97,10.19) v1(14.1,11.55) v1(14.1,10.28) v1(14.85,11.55) v1(14.86,10.3) v1(15.62,11.55) v1(15.66,10.3)
$1N5429: length 3.3
  Top Layer w0.508: R28.2 2.64,9.46 C18.2 1.12,9.45 R27.1
$1N5438: length 7.2
  Top Layer w0.254: R38.2 3.56,8.6 3.56,11.11
  Top Layer w0.508: U16.4 2.89,11.11 R28.1 1.17,10.91 C18.1

## Copper pours and planes (outline as drawn; the poured copper is in the pictures)
3V3 on Top Layer: 16.31,13.84 18.97,13.84 18.97,10.92 16.31,10.92
3V3 on Top Layer: 18.29,12.95 25.02,12.95 25.02,12.06 18.29,12.06
3V3 on Bottom Layer: 19.12,12.95 26.82,12.95 26.82,11.68 19.12,11.68
12V on Top Layer: 6.22,14.09 13.34,14.09 13.34,10.03 6.22,10.03
12V on Top Layer: 8.38,23.62 25.45,23.62 25.45,18.86 8.38,18.86
GND on Top Layer: 5.97,9.99 13.32,9.99 13.32,3.64 5.97,3.64
GND on Top Layer: 33.57,7.82 36.69,7.82 36.69,6 33.57,6
GND on Top Layer: 9.53,19.05 18.88,19.05 18.88,16.13 9.53,16.13
GND on Top Layer: 18.57,19.25 21.59,19.25 21.59,16.17 18.57,16.17
GND on Bottom Layer: 21.57,18.65 23.15,18.65 23.15,16.17 21.57,16.17
GND on Bottom Layer: 0.25,23.75 18.92,23.75 18.92,0 0.25,0
GND on Bottom Layer: 18.08,23.75 35.5,23.75 35.5,20.21 18.08,20.21
GND on Bottom Layer: 18.08,24.08 36.82,24.08 36.82,-0.38 18.08,-0.38
$1N3317 on Top Layer: 28.66,15.97 30.23,15.97 30.23,13.52 28.66,13.52
$1N3317 on Bottom Layer: 27.81,15.87 30.23,15.87 30.23,12.7 27.81,12.7
$1N4858 on Top Layer: 5.97,10.54 9.4,10.54 9.4,9.84 5.97,9.84
$1N4858 on Top Layer: 13.7,12.06 16,12.06 16,9.67 13.7,9.67
$1N4858 on Top Layer: 5.97,7.87 8,7.87 8,6.65 5.97,6.65
$1N4858 on Bottom Layer: 6.74,11.17 9.53,11.17 9.53,6.64 6.74,6.64
$1N4858 on Bottom Layer: 7.37,12.06 16,12.06 16,9.78 7.37,9.78

## Text on the board
Bottom Silkscreen Layer: By ConstString | V1.3 | PD FAN | GND | VM | SIN | PWM
Top Silkscreen Layer: Insertion Direction | BOOT1 | BOOT0 | Please Check! | PD FAN V1.3 | SWD
